# EAGLE design Pulsar Template (EAGLE 5.11)
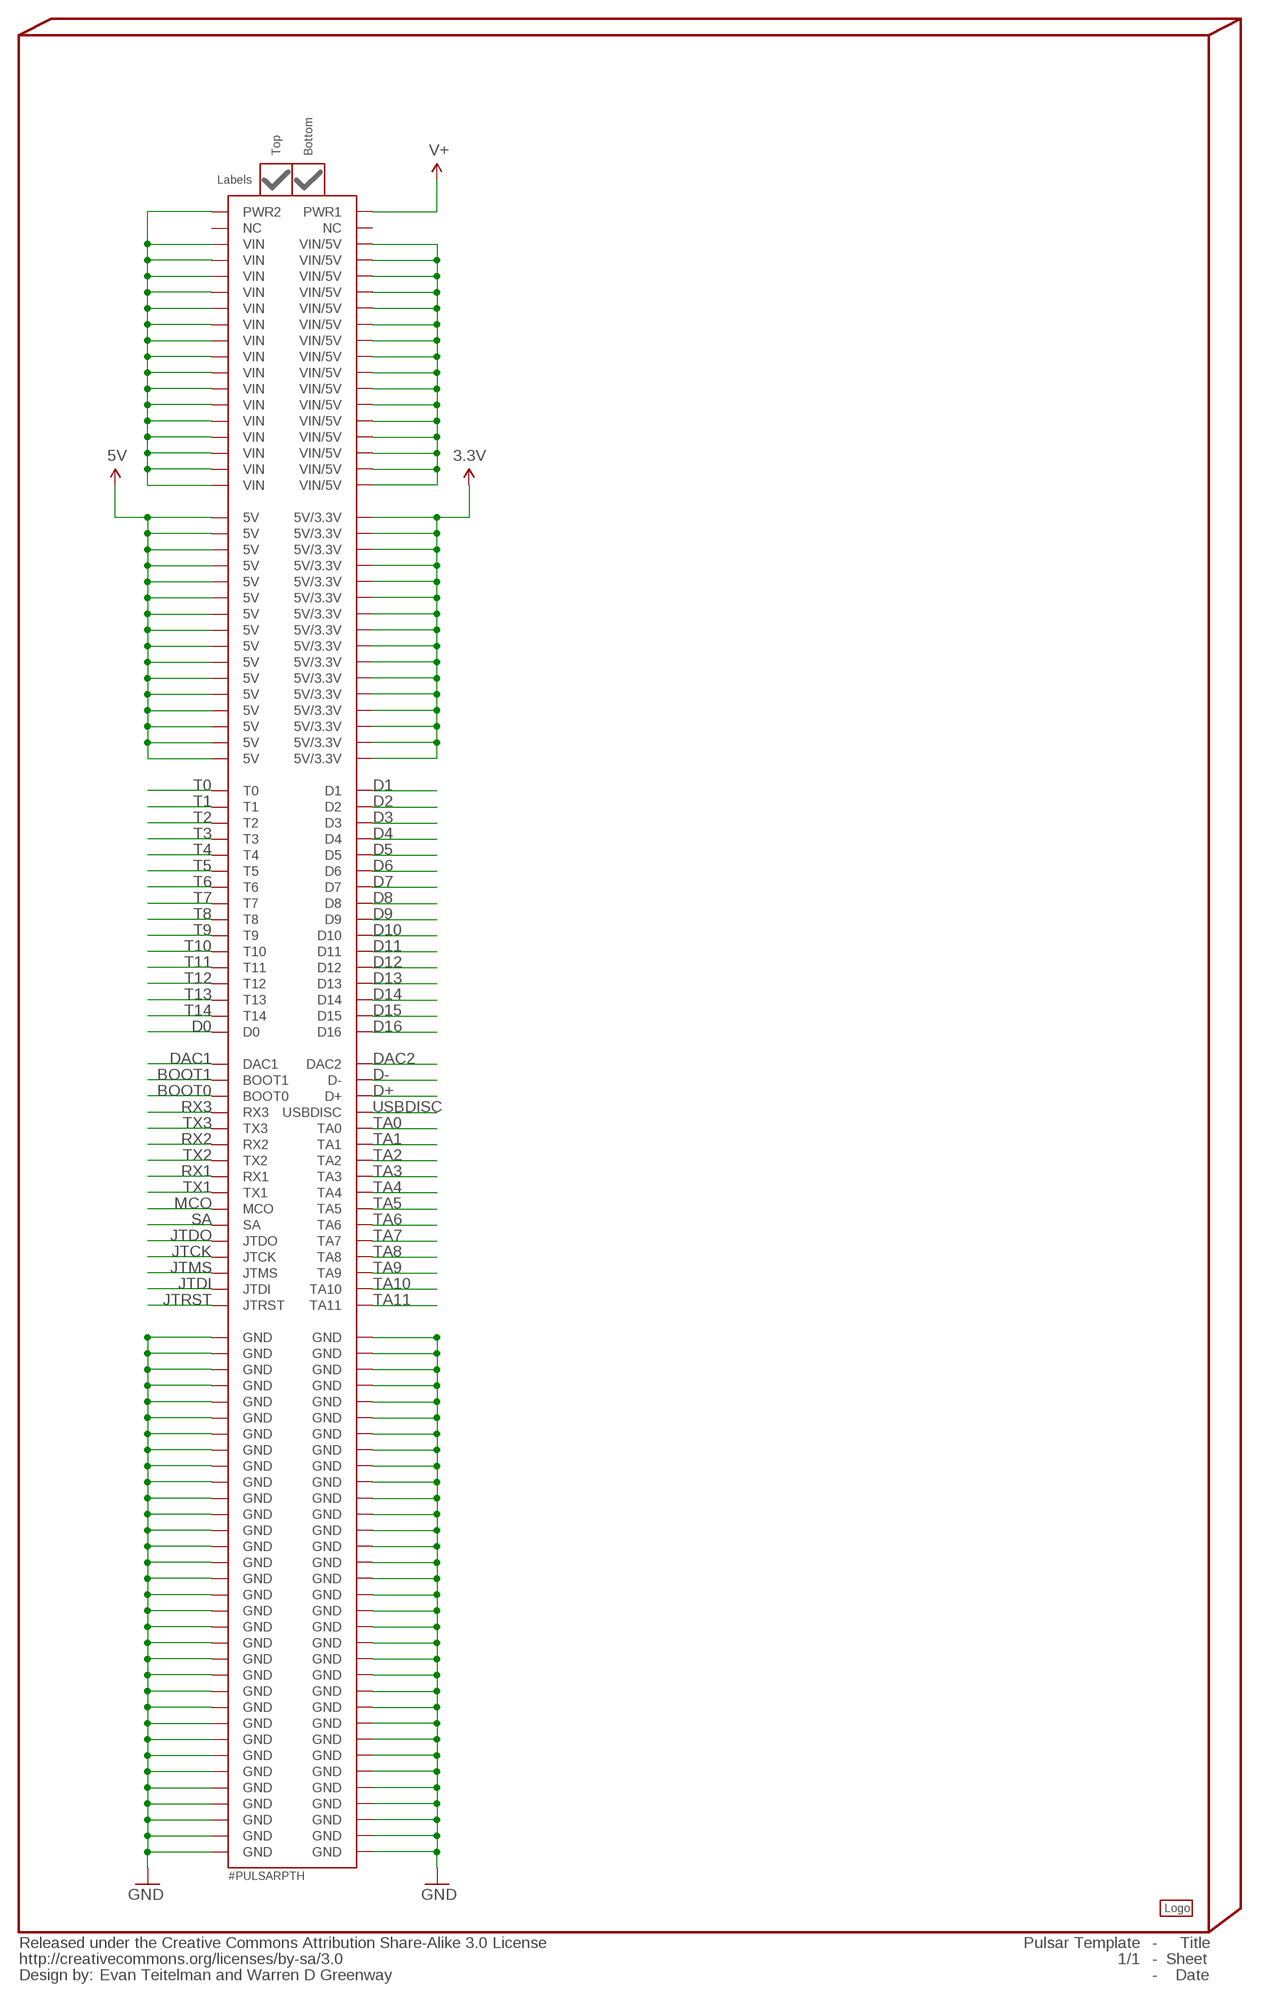
[diagram p0: schematic, sheet 1]

## Parts
FP1  #PULSARPTH  [#PULSAR-PTH]
INFO7  Evan Teitelman and Warren D Greenway  %CC-BY-SA  [%CC-BY-SA]
LOGO1  #LOGOA-THICK  [#LOGOA-THICK]
PULSARPART1  #PULSAR-PARTLABELS-TOP  [#PULSAR-LABELS-TOP]

## Nets
5V: FP1.5V1(5V) FP1.5V2(5V) FP1.5V3(5V) FP1.5V4(5V) FP1.5V5(5V) FP1.5V6(5V) FP1.5V7(5V) FP1.5V8(5V) FP1.5V9(5V) FP1.5V10(5V) FP1.5V11(5V) FP1.5V12(5V) FP1.5V13(5V) FP1.5V14(5V) FP1.5V15(5V) FP1.5V16(5V) ; supply symbol labelled @5V
5V/3.3V: FP1.5V/3.3V1(5V/3.3V) FP1.5V/3.3V2(5V/3.3V) FP1.5V/3.3V3(5V/3.3V) FP1.5V/3.3V4(5V/3.3V) FP1.5V/3.3V5(5V/3.3V) FP1.5V/3.3V6(5V/3.3V) FP1.5V/3.3V7(5V/3.3V) FP1.5V/3.3V8(5V/3.3V) FP1.5V/3.3V9(5V/3.3V) FP1.5V/3.3V10(5V/3.3V) FP1.5V/3.3V11(5V/3.3V) FP1.5V/3.3V12(5V/3.3V) FP1.5V/3.3V13(5V/3.3V) FP1.5V/3.3V14(5V/3.3V) FP1.5V/3.3V15(5V/3.3V) FP1.5V/3.3V16(5V/3.3V)
BOOT0: FP1.BOOT0
BOOT1: FP1.BOOT1
D0: FP1.D0
D1: FP1.D1
D2: FP1.D2
D3: FP1.D3
D4: FP1.D4
D5: FP1.D5
D6: FP1.D6
D7: FP1.D7
D8: FP1.D8
D9: FP1.D9
D10: FP1.D10
D11: FP1.D11
D12: FP1.D12
D13: FP1.D13
D14: FP1.D14
D15: FP1.D15
D16: FP1.D16
D+: FP1.D+
D-: FP1.D-
DAC1: FP1.DAC1
DAC2: FP1.DAC2
GND: FP1.GND1(GND) FP1.GND2(GND) FP1.GND3(GND) FP1.GND4(GND) FP1.GND5(GND) FP1.GND6(GND) FP1.GND7(GND) FP1.GND8(GND) FP1.GND9(GND) FP1.GND10(GND) FP1.GND11(GND) FP1.GND12(GND) FP1.GND13(GND) FP1.GND14(GND) FP1.GND15(GND) FP1.GND16(GND) FP1.GND17(GND) FP1.GND18(GND) FP1.GND19(GND) FP1.GND20(GND) FP1.GND21(GND) FP1.GND22(GND) FP1.GND23(GND) FP1.GND24(GND) FP1.GND25(GND) FP1.GND26(GND) FP1.GND27(GND) FP1.GND28(GND) FP1.GND29(GND) FP1.GND30(GND) FP1.GND31(GND) FP1.GND32(GND) FP1.GND33(GND) FP1.GND34(GND) FP1.GND35(GND) FP1.GND36(GND) FP1.GND37(GND) FP1.GND38(GND) FP1.GND39(GND) FP1.GND40(GND) FP1.GND41(GND) FP1.GND42(GND) FP1.GND43(GND) FP1.GND44(GND) FP1.GND45(GND) FP1.GND46(GND) FP1.GND47(GND) FP1.GND48(GND) FP1.GND49(GND) FP1.GND50(GND) FP1.GND51(GND) FP1.GND52(GND) FP1.GND53(GND) FP1.GND54(GND) FP1.GND55(GND) FP1.GND56(GND) FP1.GND57(GND) FP1.GND58(GND) FP1.GND59(GND) FP1.GND60(GND) FP1.GND61(GND) FP1.GND62(GND) FP1.GND63(GND) FP1.GND64(GND) FP1.GND65(GND) FP1.GND66(GND) ; supply symbol labelled @GND
JTCK: FP1.JTCK
JTDI: FP1.JTDI
JTDO: FP1.JTDO
JTMS: FP1.JTMS
JTRST: FP1.JTRST
MCO: FP1.MCO
RX1: FP1.RX1
RX2: FP1.RX2
RX3: FP1.RX3
SA: FP1.SA
T0: FP1.T0
T1: FP1.T1
T2: FP1.T2
T3: FP1.T3
T4: FP1.T4
T5: FP1.T5
T6: FP1.T6
T7: FP1.T7
T8: FP1.T8
T9: FP1.T9
T10: FP1.T10
T11: FP1.T11
T12: FP1.T12
T13: FP1.T13
T14: FP1.T14
TA0: FP1.TA0
TA1: FP1.TA1
TA2: FP1.TA2
TA3: FP1.TA3
TA4: FP1.TA4
TA5: FP1.TA5
TA6: FP1.TA6
TA7: FP1.TA7
TA8: FP1.TA8
TA9: FP1.TA9
TA10: FP1.TA10
TA11: FP1.TA11
TX1: FP1.TX1
TX2: FP1.TX2
TX3: FP1.TX3
USBDISC: FP1.USBDISC
V+: FP1.PWR1 ; supply symbol labelled @V+
VIN: FP1.PWR2 FP1.VIN1(VIN) FP1.VIN2(VIN) FP1.VIN3(VIN) FP1.VIN4(VIN) FP1.VIN5(VIN) FP1.VIN6(VIN) FP1.VIN7(VIN) FP1.VIN8(VIN) FP1.VIN9(VIN) FP1.VIN10(VIN) FP1.VIN11(VIN) FP1.VIN12(VIN) FP1.VIN13(VIN) FP1.VIN14(VIN) FP1.VIN15(VIN) FP1.VIN16(VIN)
VIN/5V: FP1.VIN/5V1(VIN/5V) FP1.VIN/5V2(VIN/5V) FP1.VIN/5V3(VIN/5V) FP1.VIN/5V4(VIN/5V) FP1.VIN/5V5(VIN/5V) FP1.VIN/5V6(VIN/5V) FP1.VIN/5V7(VIN/5V) FP1.VIN/5V8(VIN/5V) FP1.VIN/5V9(VIN/5V) FP1.VIN/5V10(VIN/5V) FP1.VIN/5V11(VIN/5V) FP1.VIN/5V12(VIN/5V) FP1.VIN/5V13(VIN/5V) FP1.VIN/5V14(VIN/5V) FP1.VIN/5V15(VIN/5V) FP1.VIN/5V16(VIN/5V)
Unconnected: FP1.NULL1(NC) FP1.NULL2(NC)

## Library data of the parts
FP1 = PygmyBoards:#PULSAR: Pulsar Board and Shield Footprint Pads This is the only absolutely required part for the footprint. The parts in "#PULSAR-PART" are merely aesthetic. Reference board outline provided on the Document (48) layer.
INFO7 = PygmyBoards:%CC-BY-SA: Creative Commons Attribution-ShareAlike License <http://creativecommons.org/licenses/by-sa/3.0/>
LOGO1 = PygmyBoards:#LOGO
PULSARPART1 = PygmyBoards:#PULSAR-PART: Pulsar Board and Shield Footprint Parts These parts are only functional when combined with the pads in "#PULSAR".

## Board
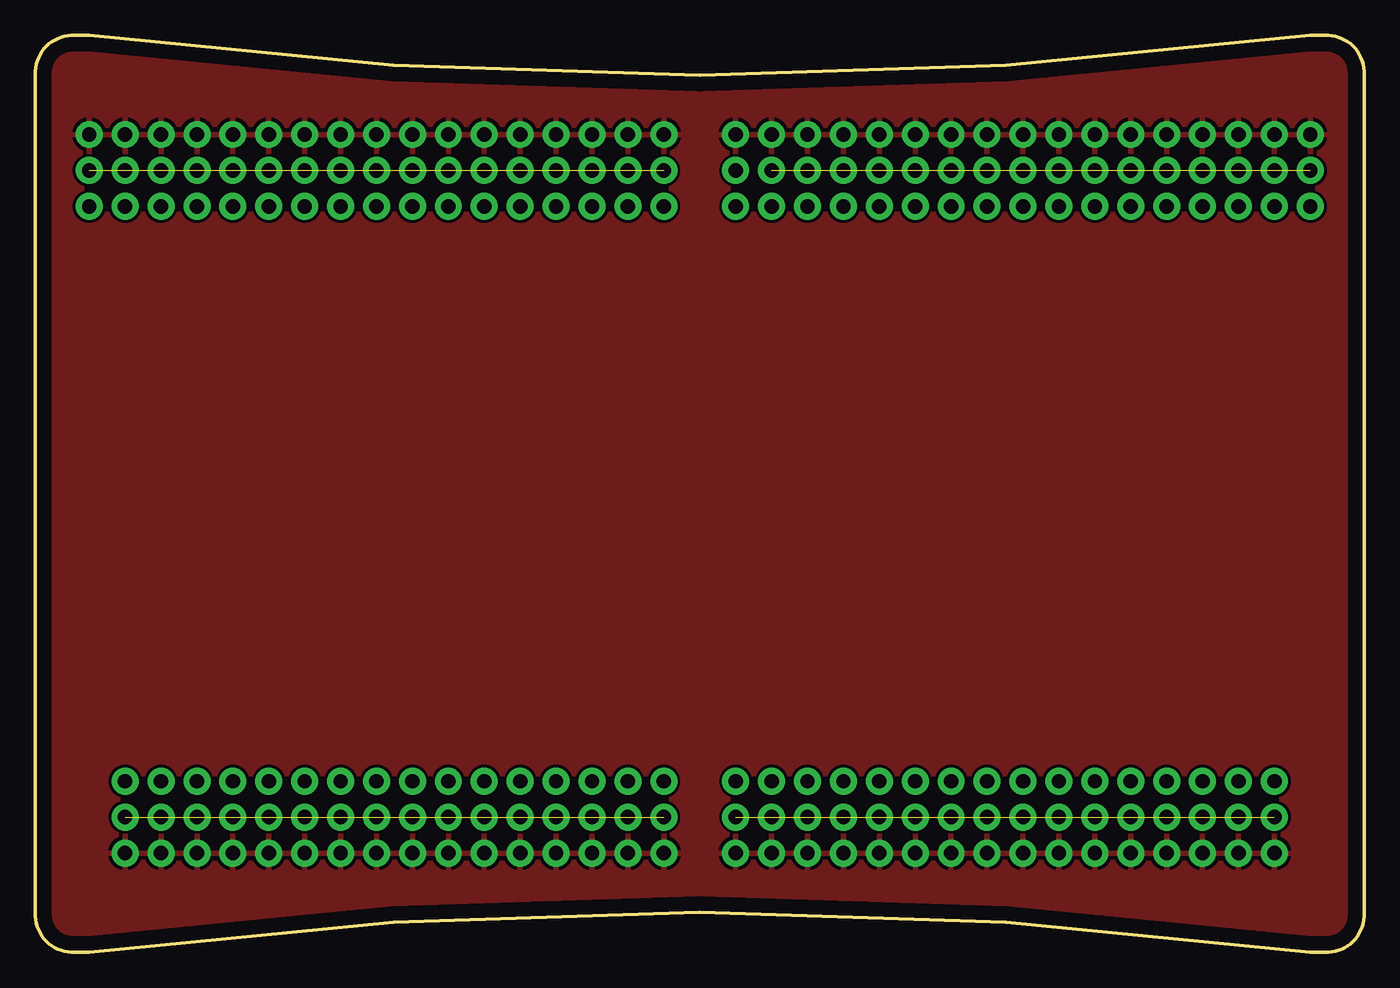
[diagram p1: board, top side]
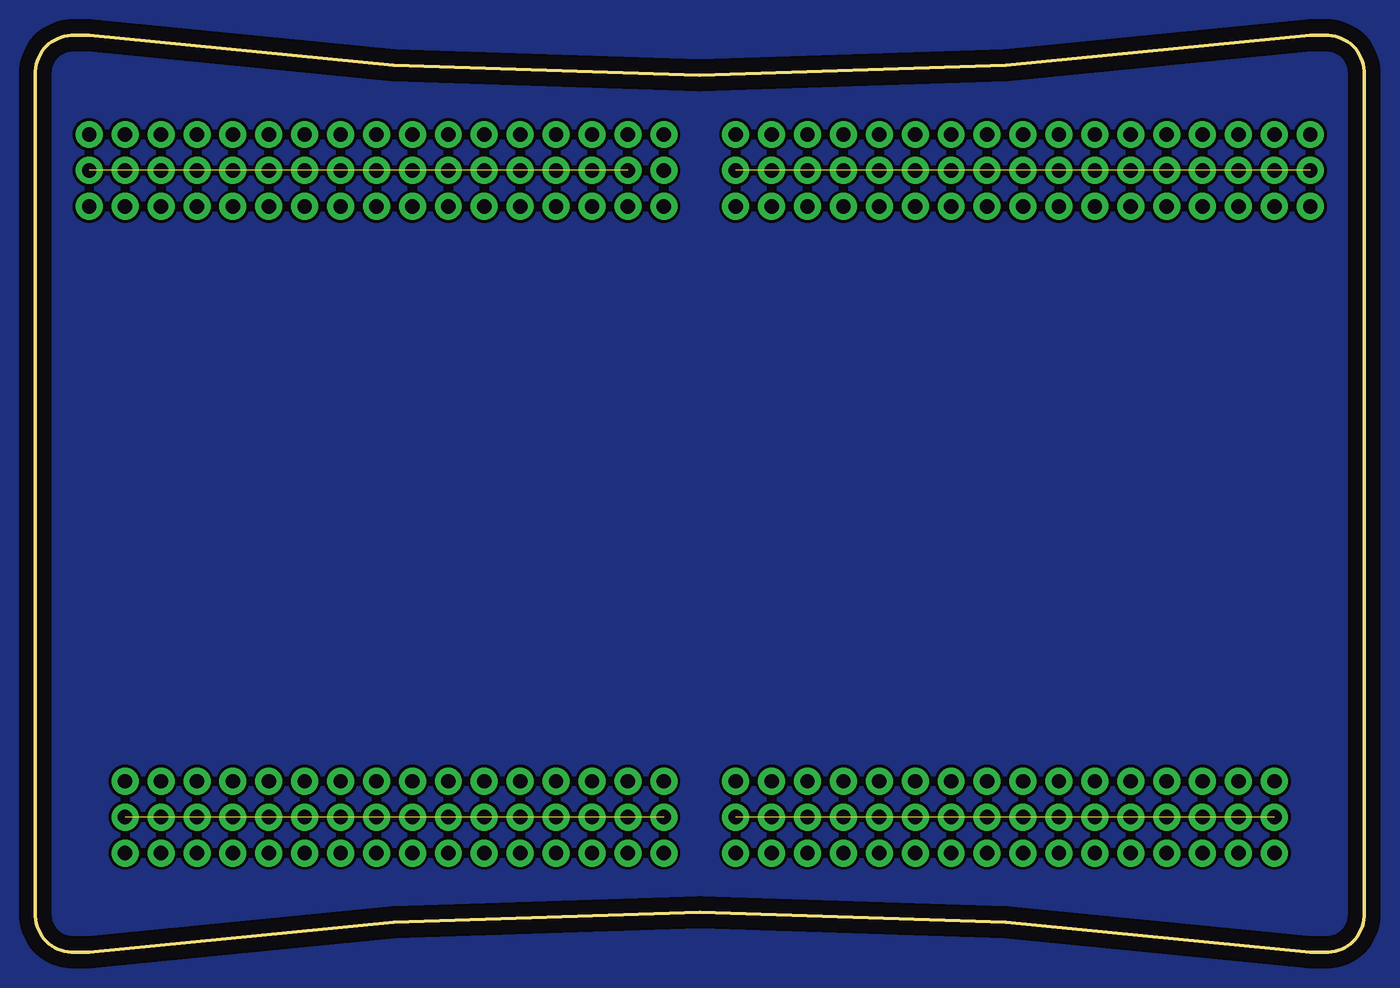
[diagram p2: board, bottom side, seen from below]

Size 93.98 x 64.82 mm. Coordinates in mm from the lower left corner, seen from the top.
Outline: 0,62.28 0,2.54 arc85 2.54,0 3.81,0 arc-15 90.17,0 91.44,0 arc85 93.98,2.54 93.98,62.28 arc85 91.44,64.82 90.17,64.82 arc-15 3.81,64.82 2.54,64.82 arc85 0,62.28
Copper layers (1*16): Top 0.035mm / dielectric 1.5mm / Bottom 0.035mm
Design rules "default": minimum track width 10mil, minimum drill 0.6mm, track to track 8mil, track to pad 8mil, pad to pad 8mil, via to via 8mil, smd to smd 8mil, copper to edge 40mil, drill to drill 8mil, minimum pad ring 10mil, minimum via ring 8mil, stop-mask expansion 4mil, vias tented up to drill 0mil, thermal gap 10mil

### Footprints (pad centres in the part's own frame; a part is rotated, then mirrored left to right if it is on the bottom)
#PULSAR-PTH = drill 1.016 pad 1.905 round: 5V1 -87.63,-55.88; 5V2 -85.09,-55.88; 5V3 -82.55,-55.88; 5V4 -80.01,-55.88; 5V5 -77.47,-55.88; 5V6 -74.93,-55.88; 5V7 -72.39,-55.88; 5V8 -69.85,-55.88; 5V9 -67.31,-55.88; 5V10 -64.77,-55.88; 5V11 -62.23,-55.88; 5V12 -59.69,-55.88; 5V13 -57.15,-55.88; 5V14 -54.61,-55.88; 5V15 -52.07,-55.88; 5V16 -49.53,-55.88; 5V/3.3V1 -44.45,-55.88; 5V/3.3V2 -41.91,-55.88; 5V/3.3V3 -39.37,-55.88; 5V/3.3V4 -36.83,-55.88; 5V/3.3V5 -34.29,-55.88; 5V/3.3V6 -31.75,-55.88; 5V/3.3V7 -29.21,-55.88; 5V/3.3V8 -26.67,-55.88; 5V/3.3V9 -24.13,-55.88; 5V/3.3V10 -21.59,-55.88; 5V/3.3V11 -19.05,-55.88; 5V/3.3V12 -16.51,-55.88; 5V/3.3V13 -13.97,-55.88; 5V/3.3V14 -11.43,-55.88; 5V/3.3V15 -8.89,-55.88; 5V/3.3V16 -6.35,-55.88; BOOT0 -82.55,-53.34; BOOT1 -85.09,-53.34; D0 -49.53,-12.7; D1 -41.91,-12.7; D2 -39.37,-12.7; D3 -36.83,-12.7; D4 -34.29,-12.7; D5 -31.75,-12.7; D6 -29.21,-12.7; D7 -26.67,-12.7; D8 -24.13,-12.7; D9 -21.59,-12.7; D10 -19.05,-12.7; D11 -16.51,-12.7; D12 -13.97,-12.7; D13 -11.43,-12.7; D14 -8.89,-12.7; D15 -6.35,-12.7; D16 -3.81,-12.7; D+ -11.43,-53.34; D- -8.89,-53.34; DAC1 -87.63,-53.34; DAC2 -6.35,-53.34; GND1 -87.63,-58.42; GND2 -85.09,-58.42; GND3 -82.55,-58.42; GND4 -80.01,-58.42; GND5 -77.47,-58.42; GND6 -74.93,-58.42; GND7 -72.39,-58.42; GND8 -69.85,-58.42; GND9 -67.31,-58.42; GND10 -64.77,-58.42; GND11 -62.23,-58.42; GND12 -59.69,-58.42; GND13 -57.15,-58.42; GND14 -54.61,-58.42; GND15 -52.07,-58.42; GND16 -49.53,-58.42; GND17 -44.45,-58.42; GND18 -41.91,-58.42; GND19 -39.37,-58.42; GND20 -36.83,-58.42; GND21 -34.29,-58.42; GND22 -31.75,-58.42; GND23 -29.21,-58.42; GND24 -26.67,-58.42; GND25 -24.13,-58.42; GND26 -21.59,-58.42; GND27 -19.05,-58.42; GND28 -16.51,-58.42; GND29 -13.97,-58.42; GND30 -11.43,-58.42; GND31 -8.89,-58.42; GND32 -6.35,-58.42; GND33 -3.81,-7.62; GND34 -6.35,-7.62; GND35 -8.89,-7.62; GND36 -11.43,-7.62; GND37 -13.97,-7.62; GND38 -16.51,-7.62; GND39 -19.05,-7.62; GND40 -21.59,-7.62; GND41 -24.13,-7.62; GND42 -26.67,-7.62; GND43 -29.21,-7.62; GND44 -31.75,-7.62; GND45 -34.29,-7.62; GND46 -36.83,-7.62; GND47 -39.37,-7.62; GND48 -41.91,-7.62; GND49 -44.45,-7.62; GND50 -49.53,-7.62; GND51 -52.07,-7.62; GND52 -54.61,-7.62; GND53 -57.15,-7.62; GND54 -59.69,-7.62; GND55 -62.23,-7.62; GND56 -64.77,-7.62; GND57 -67.31,-7.62; GND58 -69.85,-7.62; GND59 -72.39,-7.62; GND60 -74.93,-7.62; GND61 -77.47,-7.62; GND62 -80.01,-7.62; GND63 -82.55,-7.62; GND64 -85.09,-7.62; GND65 -87.63,-7.62; GND66 -90.17,-7.62; JTCK -57.15,-53.34; JTDI -52.07,-53.34; JTDO -59.69,-53.34; JTMS -54.61,-53.34; JTRST -49.53,-53.34; MCO -64.77,-53.34; NULL1 -44.45,-12.7; NULL2 -90.17,-12.7; PWR1 -44.45,-10.16; PWR2 -90.17,-10.16; RX1 -69.85,-53.34; RX2 -74.93,-53.34; RX3 -80.01,-53.34; SA -62.23,-53.34; T0 -87.63,-12.7; T1 -85.09,-12.7; T2 -82.55,-12.7; T3 -80.01,-12.7; T4 -77.47,-12.7; T5 -74.93,-12.7; T6 -72.39,-12.7; T7 -69.85,-12.7; T8 -67.31,-12.7; T9 -64.77,-12.7; T10 -62.23,-12.7; T11 -59.69,-12.7; T12 -57.15,-12.7; T13 -54.61,-12.7; T14 -52.07,-12.7; TA0 -16.51,-53.34; TA1 -19.05,-53.34; TA2 -21.59,-53.34; TA3 -24.13,-53.34; TA4 -26.67,-53.34; TA5 -29.21,-53.34; TA6 -31.75,-53.34; TA7 -34.29,-53.34; TA8 -36.83,-53.34; TA9 -39.37,-53.34; TA10 -41.91,-53.34; TA11 -44.45,-53.34; TX1 -67.31,-53.34; TX2 -72.39,-53.34; TX3 -77.47,-53.34; USBDISC -13.97,-53.34; VIN1 -49.53,-10.16; VIN2 -52.07,-10.16; VIN3 -54.61,-10.16; VIN4 -57.15,-10.16; VIN5 -59.69,-10.16; VIN6 -62.23,-10.16; VIN7 -64.77,-10.16; VIN8 -67.31,-10.16; VIN9 -69.85,-10.16; VIN10 -72.39,-10.16; VIN11 -74.93,-10.16; VIN12 -77.47,-10.16; VIN13 -80.01,-10.16; VIN14 -82.55,-10.16; VIN15 -85.09,-10.16; VIN16 -87.63,-10.16; VIN/5V1 -3.81,-10.16; VIN/5V2 -6.35,-10.16; VIN/5V3 -8.89,-10.16; VIN/5V4 -11.43,-10.16; VIN/5V5 -13.97,-10.16; VIN/5V6 -16.51,-10.16; VIN/5V7 -19.05,-10.16; VIN/5V8 -21.59,-10.16; VIN/5V9 -24.13,-10.16; VIN/5V10 -26.67,-10.16; VIN/5V11 -29.21,-10.16; VIN/5V12 -31.75,-10.16; VIN/5V13 -34.29,-10.16; VIN/5V14 -36.83,-10.16; VIN/5V15 -39.37,-10.16; VIN/5V16 -41.91,-10.16

### Placement (x,y rotation side)
FP1  93.98,65.43 0 top
INFO7  -3.81,-10.77 0 top  (outside the outline)
LOGO1  85.09,33.68 0 bottom
PULSARPART1  93.98,65.43 0 top

### Tracks (layer width: path | path; a pad name or v marks a point on that pad's centre or on a via)
5V  (15 unrouted)
5V/3.3V  (15 unrouted)
GND
  pour Top: -2.54,66.7 96.52,66.7 96.52,-1.88 -2.54,-1.88
N$1
  pour Bottom: -3.81,67.97 97.79,67.97 97.79,-3.15 -3.81,-3.15
VIN  (16 unrouted)
VIN/5V  (15 unrouted)

### Text on the board
bTest: <Board Name> | Design by: Evan Teitelman and Warren D Greenway
Document: <Shield Name> Version 1.0 | Standard Grid: 50mil | Min Trace Width: 6mil | Min Via Drill: 15mil | Equator | Prime Meridian